# Altium schematic sheet Periph.SchDoc
size A; SheetNumber: 6; SheetTotal: 7
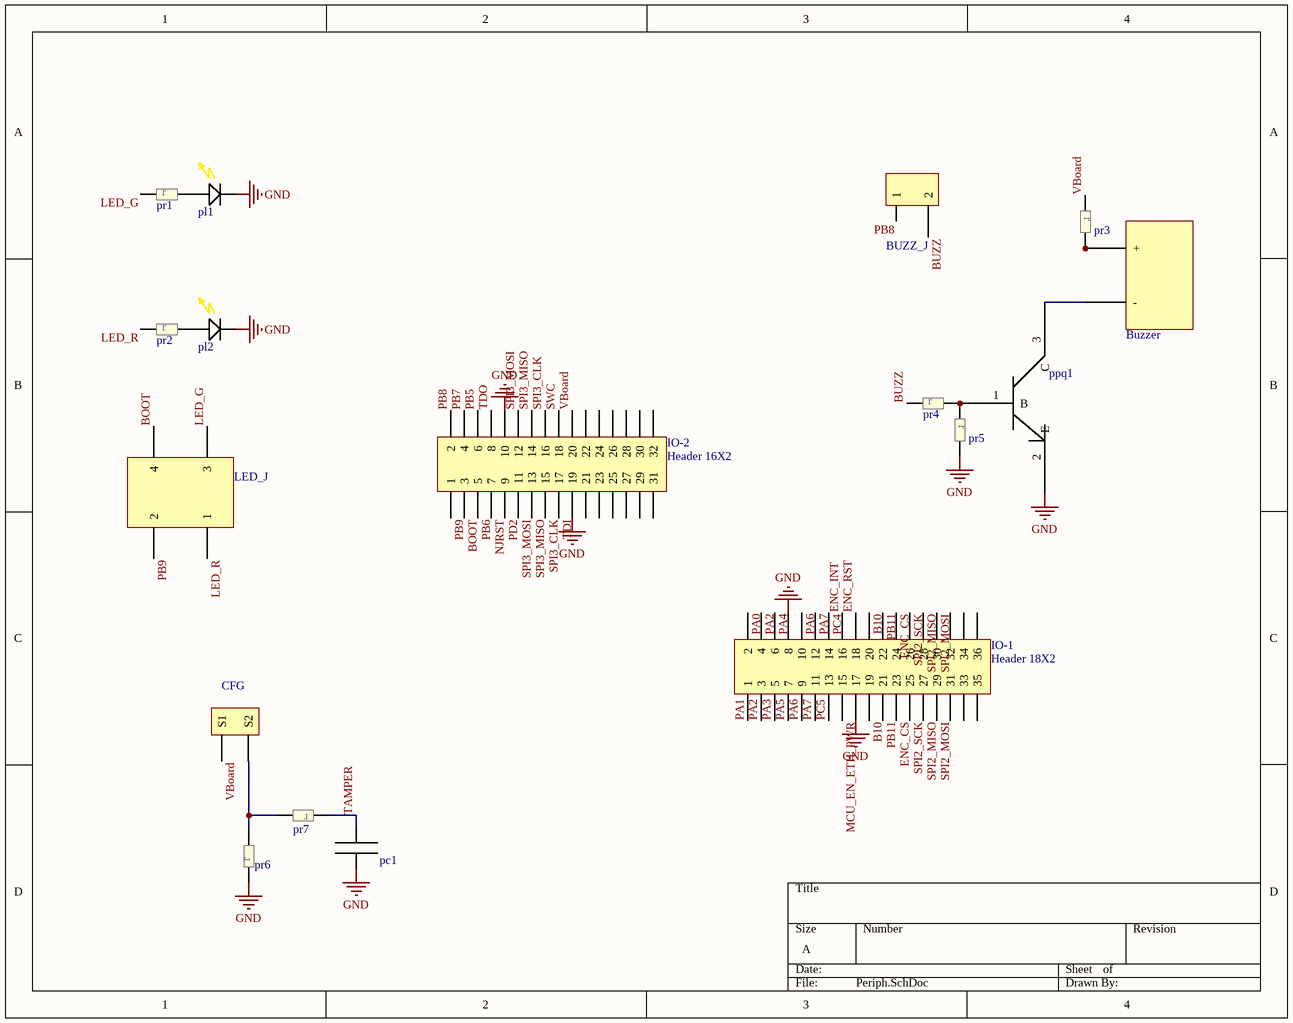
[diagram p0: Periph.SchDoc]

## Parts
BUZZ_J  pin header 2mm  [abr_ph_2x1_2mm_3d_male]  (value not drawn)
Buzzer  LED  [ABR_BUZZER_9MM_3D]  (value not drawn)
CFG  switch  [abr_sw_tact_3d]  (value not drawn)
IO-1  Header 18X2  [HDR2X18]
IO-2  Header 16X2  [HDR2X16]
LED_J  pin header 2mm  [abr_ph_2x2_2mm_3d_male]  (value not drawn)
pc1  100nf  [abr_cap_0805_3d]  (value not drawn)
pl1  smd-0805  [abr_led_g_0805_3d]  (value not drawn)
pl2  smd-0805  [abr_led_r_0805_3d]  (value not drawn)
ppq1  transistor  [abr_fp_sot-23_3d]  (value not drawn)
pr1  2.2K  [abr_res_0805_3d]  (value not drawn)
pr2  2.2K  [abr_res_0805_3d]  (value not drawn)
pr3  2.2K  [abr_res_0805_3d]  (value not drawn)
pr4  2.2K  [abr_res_0805_3d]  (value not drawn)
pr5  2.2K  [abr_res_0805_3d]  (value not drawn)
pr6  100K  [abr_res_0805_3d]  (value not drawn)
pr7  1k  [abr_res_0805_3d]  (value not drawn)

## Nets
GND: IO-1.8 IO-1.17 IO-2.10 IO-2.19 pc1.0 pl1.1 pl2.1 ppq1.2(E) pr5.1 pr6.0
B10: IO-1.19 IO-1.20
BOOT: IO-2.3 LED_J.4
BUZZ: BUZZ_J.2 pr4.0
ENC_CS: IO-1.23 IO-1.24
ENC_INT: IO-1.16
ENC_RST: IO-1.18
LED_G: LED_J.3 pr1.0
LED_R: LED_J.1 pr2.0
MCU_EN_ETH_PWR: IO-1.15
NJRST: IO-2.7
PA0: IO-1.2
PA1: IO-1.1
PA2: IO-1.3 IO-1.4
PA3: IO-1.5
PA4: IO-1.6
PA5: IO-1.7
PA6: IO-1.9 IO-1.10
PA7: IO-1.11 IO-1.12
PB5: IO-2.6
PB6: IO-2.5
PB7: IO-2.4
PB8: BUZZ_J.1 IO-2.2
PB9: IO-2.1 LED_J.2
PB11: IO-1.21 IO-1.22
PC4: IO-1.14
PC5: IO-1.13
PD2: IO-2.9
SPI2_MISO: IO-1.27 IO-1.28
SPI2_MOSI: IO-1.29 IO-1.30
SPI2_SCK: IO-1.25 IO-1.26
SPI3_CLK: IO-2.15 IO-2.16
SPI3_MISO: IO-2.13 IO-2.14
SPI3_MOSI: IO-2.11 IO-2.12
SWC: IO-2.18
TAMPER: pc1.1 pr7.0
TDI: IO-2.17
TDO: IO-2.8
VBoard: CFG.1(S1) IO-2.20 pr3.0
NetBuzzer_1: Buzzer.1(+) pr3.1
NetBuzzer_2: Buzzer.2(-) ppq1.3(C)
NetCFG_2: CFG.2(S2) pr6.1 pr7.1
Netpl1_0: pl1.0 pr1.1
Netpl2_0: pl2.0 pr2.1
Netppq1_1: ppq1.1(B) pr4.1 pr5.0

Not connected (* = marked no-connect by the designer): IO-1 31 32 33 34 35 36; IO-2 21 22 23 24 25 26 27 28 29 30 31 32

## Notes on the sheet
- (in symbol abr_res_0805) r

## Library data of the parts
BUZZ_J = abr_2x1_2mm
Buzzer = abr_buzzer
CFG = abr_switch_tact
IO-1 = Header 18X2: Header, 18-Pin, Dual row; LatestRevisionDate: 17-Jul-2002; LatestRevisionNote: Re-released for DXP Platform.; Publisher: Altium Limited
IO-2 = Header 16X2: Header, 16-Pin, Dual row; LatestRevisionDate: 17-Jul-2002; LatestRevisionNote: Re-released for DXP Platform.; Publisher: Altium Limited
LED_J = abr_2x2_2mm
pc1 = abr_cap_0805
pl1 pl2 = abr_led_0805
ppq1 = abr_bc847
pr1-pr7 = abr_res_0805